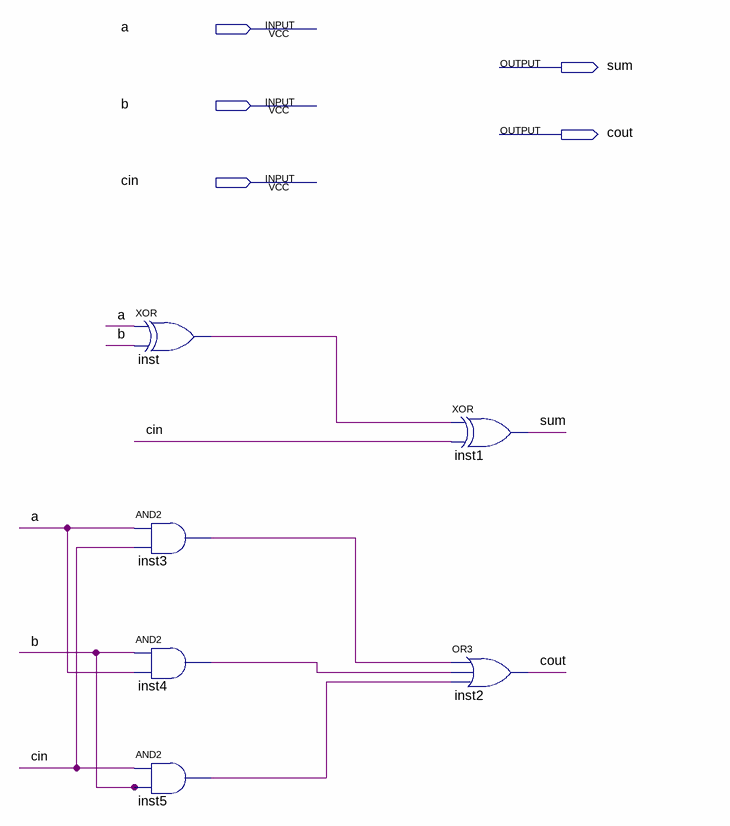
[diagram p0: schematic sheet]
// Quartus schematic Lab1_1.bdf as structural Verilog: 6 symbols, 5 pins
module Lab1_1 (
  input  a,
  input  b,
  input  cin,
  output sum,
  output cout
);

  wire inst3_out, inst4_out, inst5_out, inst_out;

  xor inst (inst_out, a, b);
  and inst3 (inst3_out, a, cin);
  and inst4 (inst4_out, b, a);
  and inst5 (inst5_out, cin, b);
  xor inst1 (sum, inst_out, cin);
  or inst2 (cout, inst3_out, inst4_out, inst5_out);
endmodule
